# EAGLE schematic wio terminal (EAGLE 9.5.2)
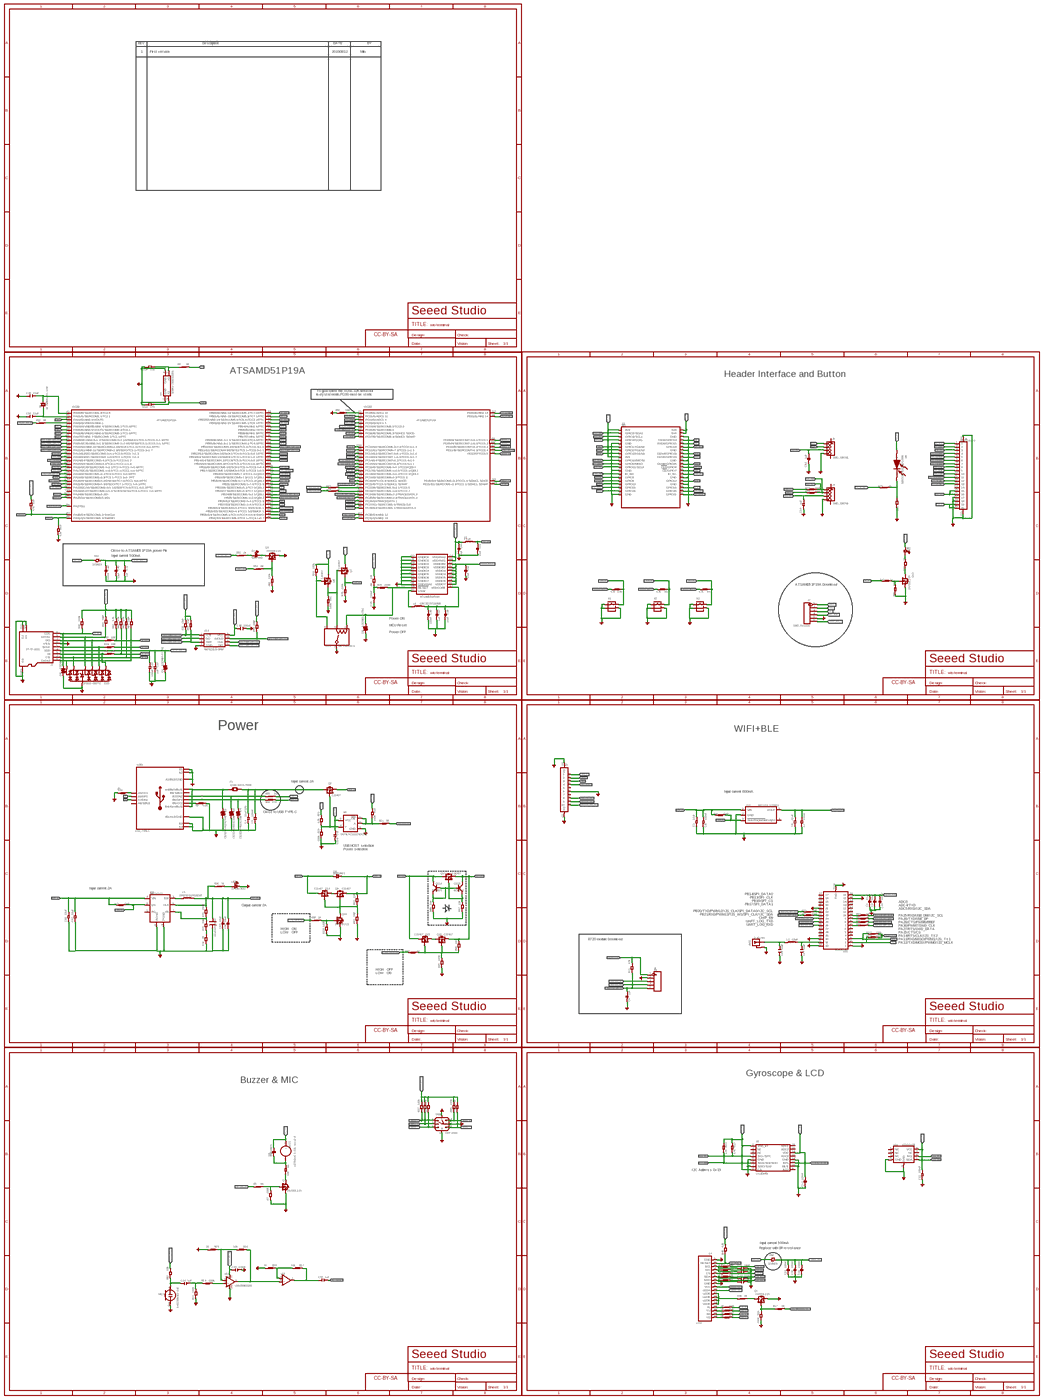
[diagram p0: schematic, sheet 1, overview]
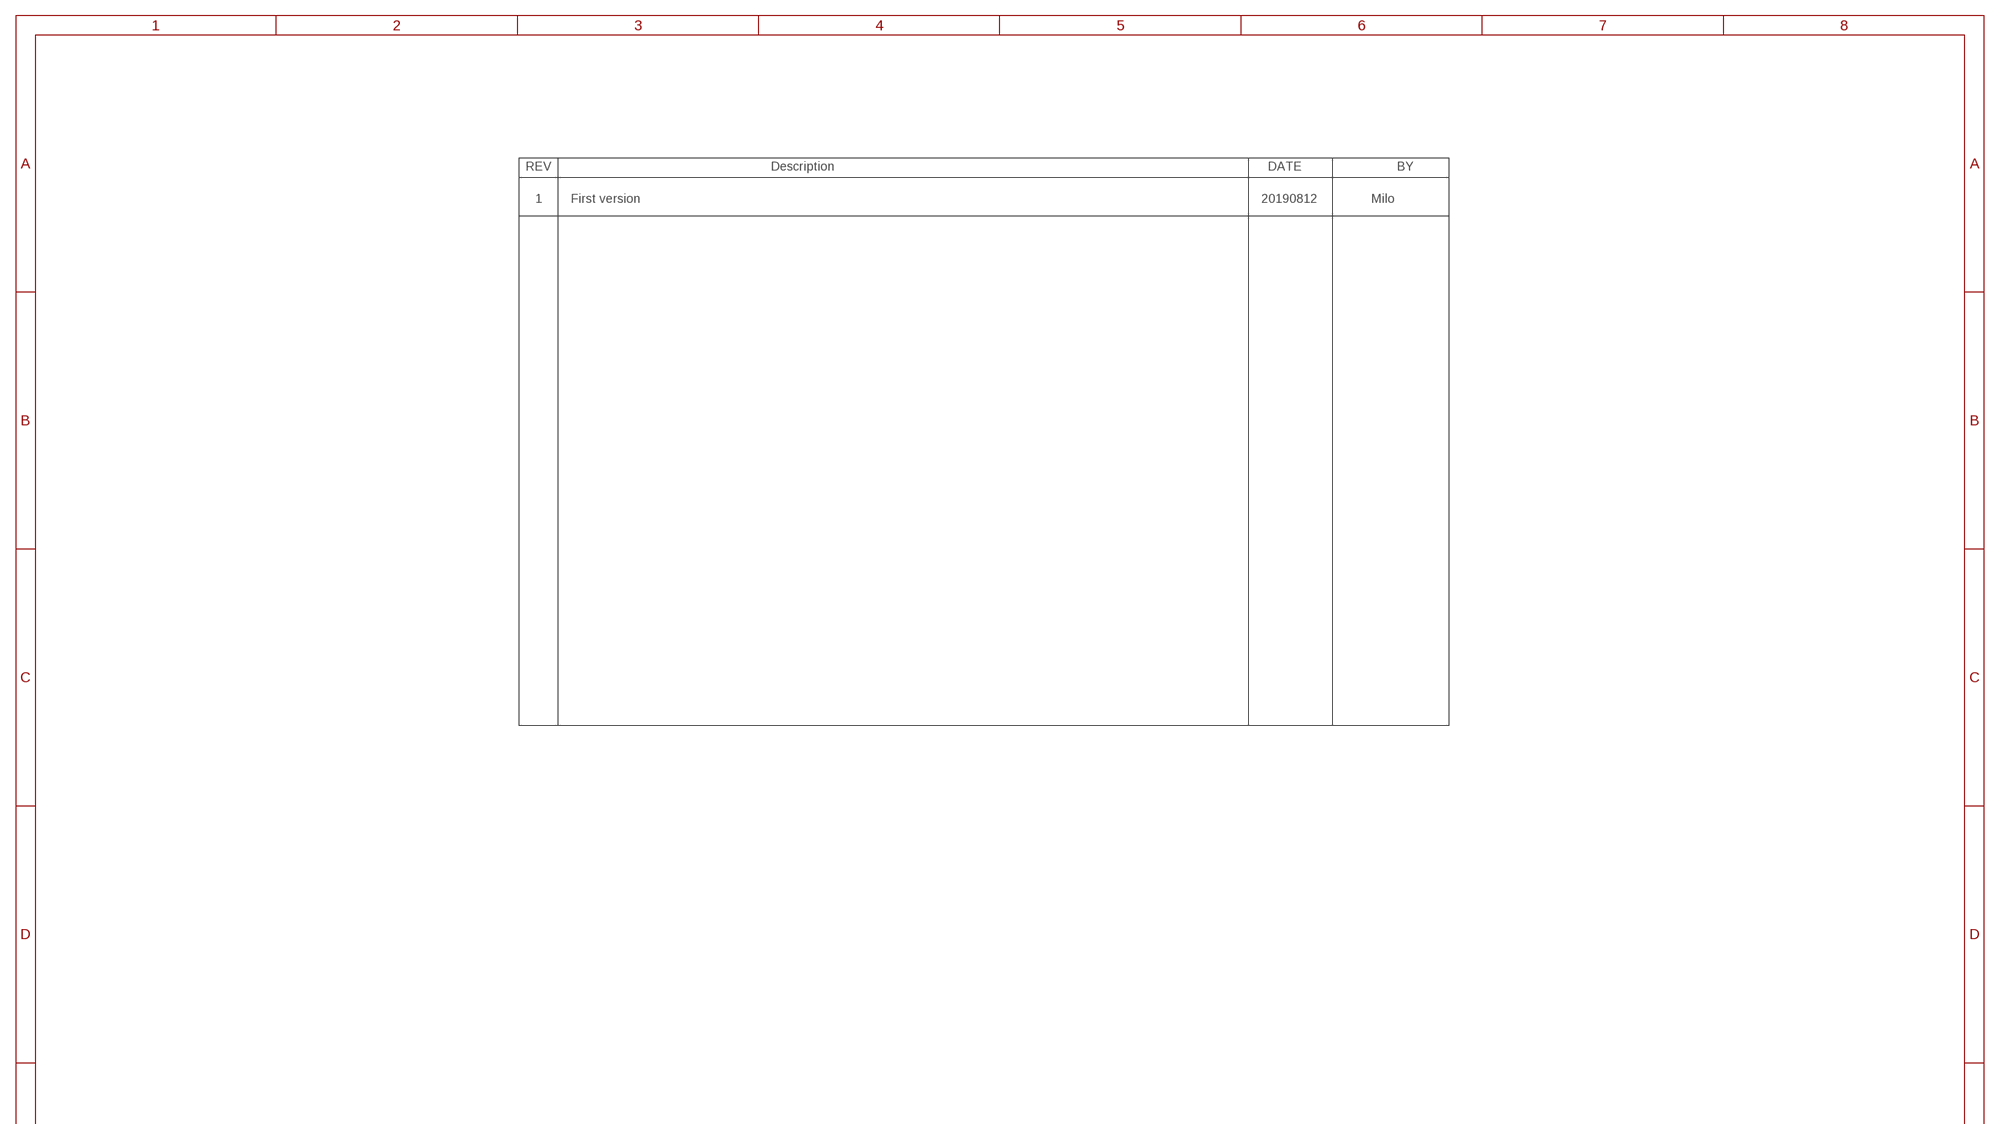
[diagram p1: schematic, sheet 1, part 1 of 7]
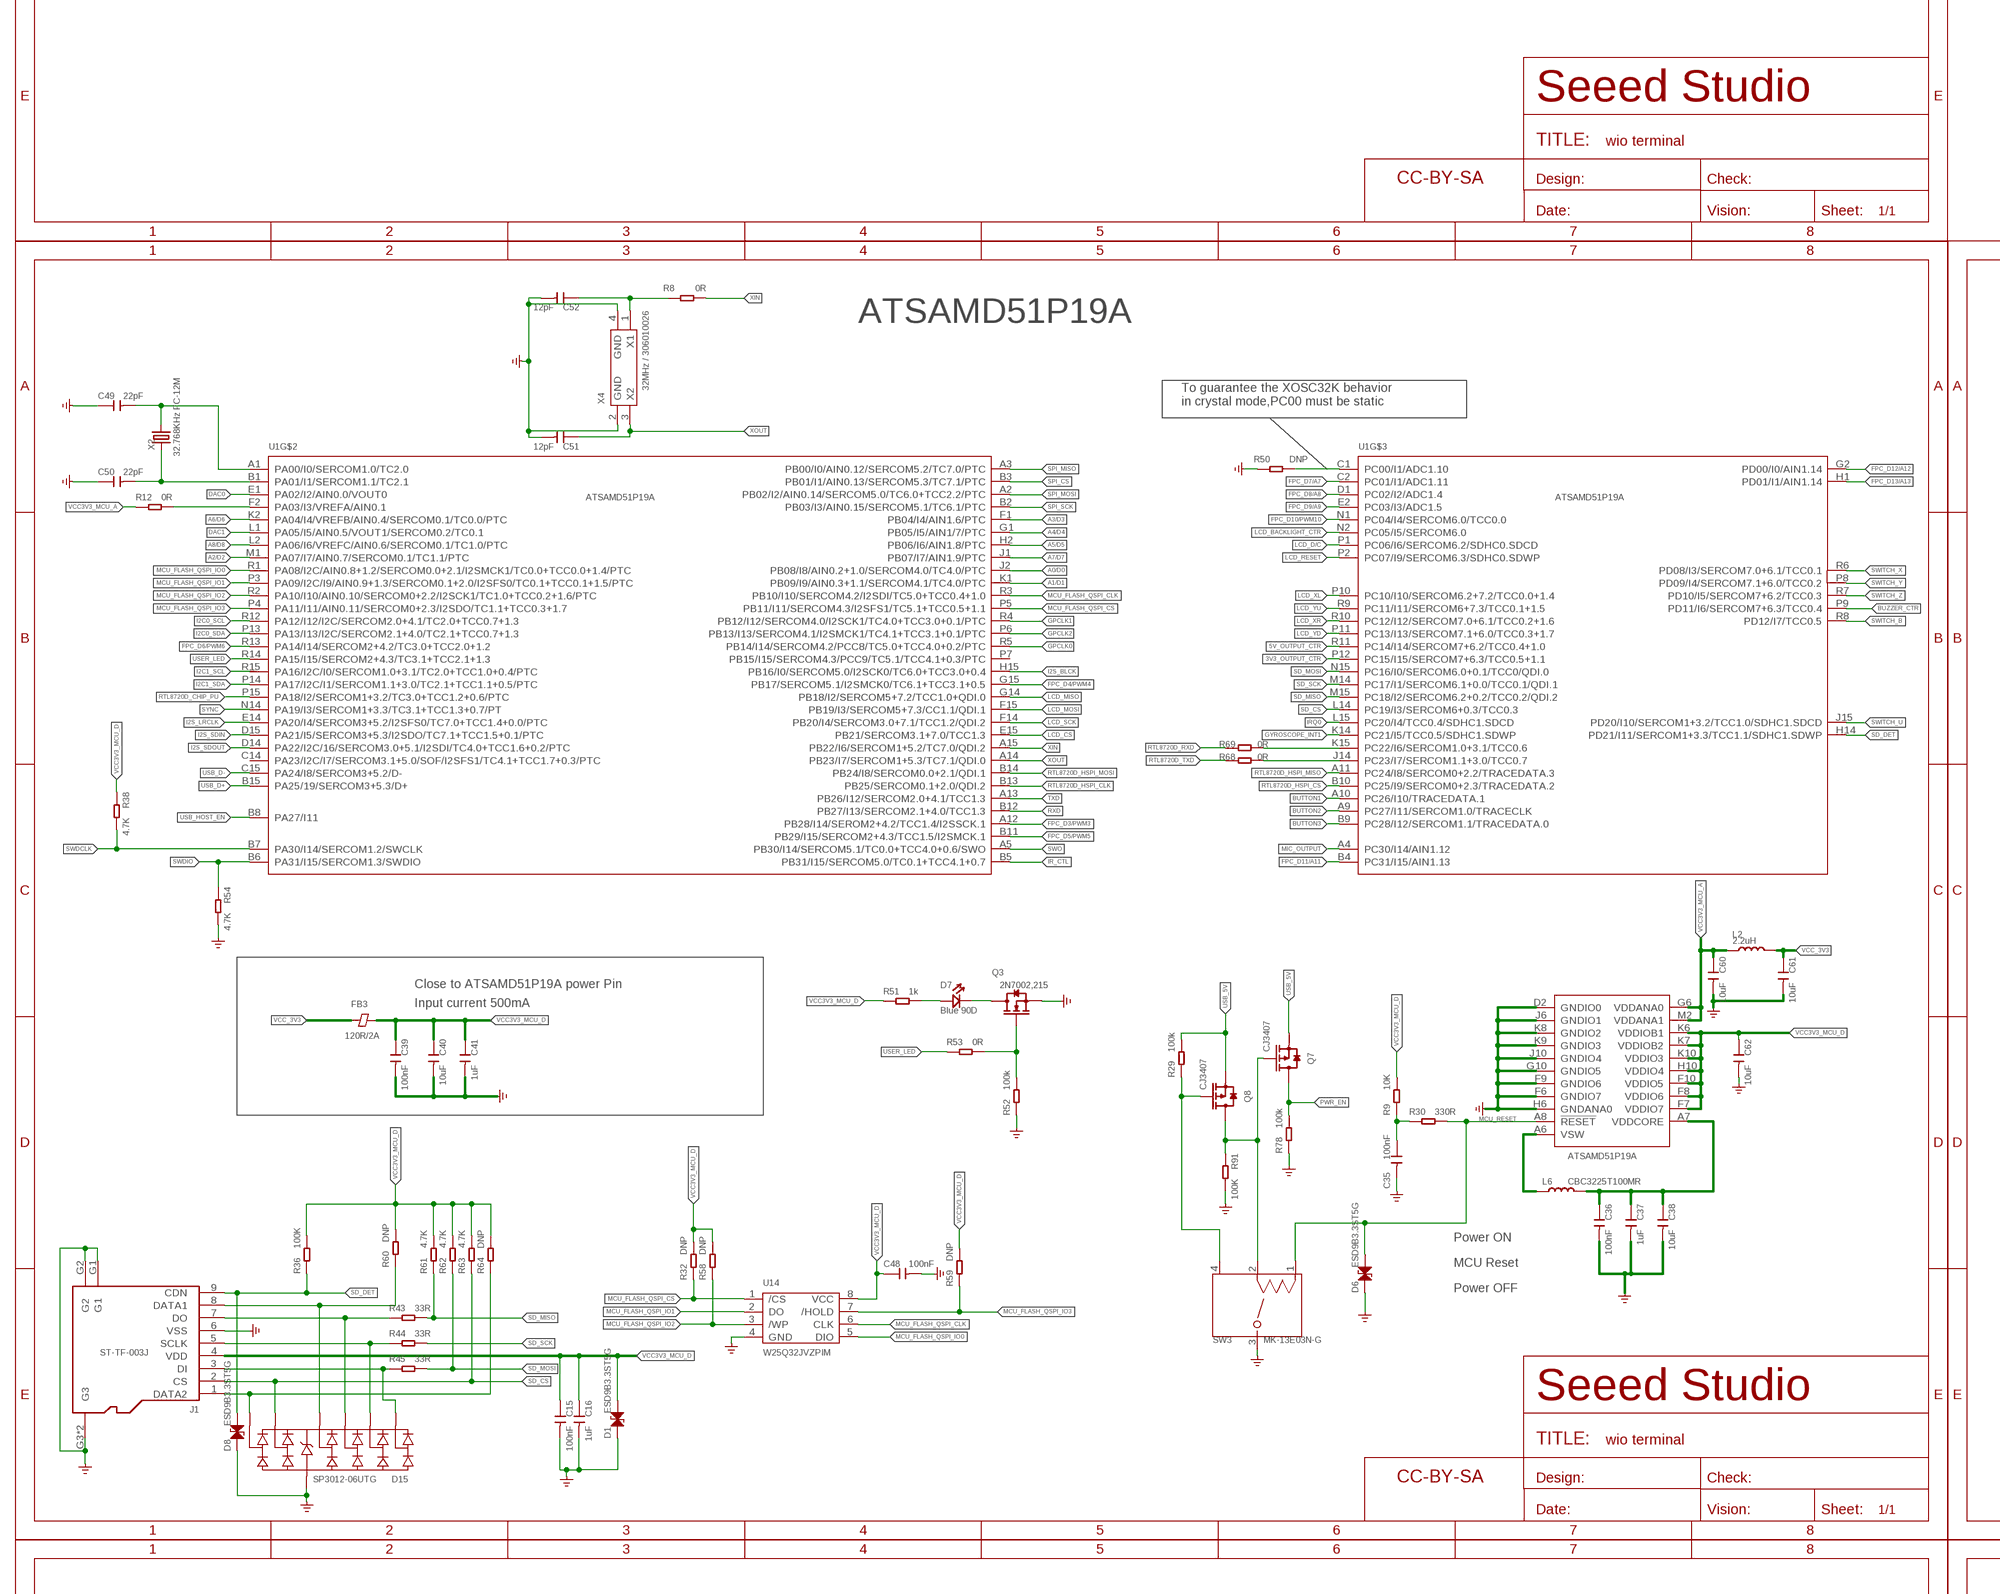
[diagram p2: schematic, sheet 1, part 2 of 7]
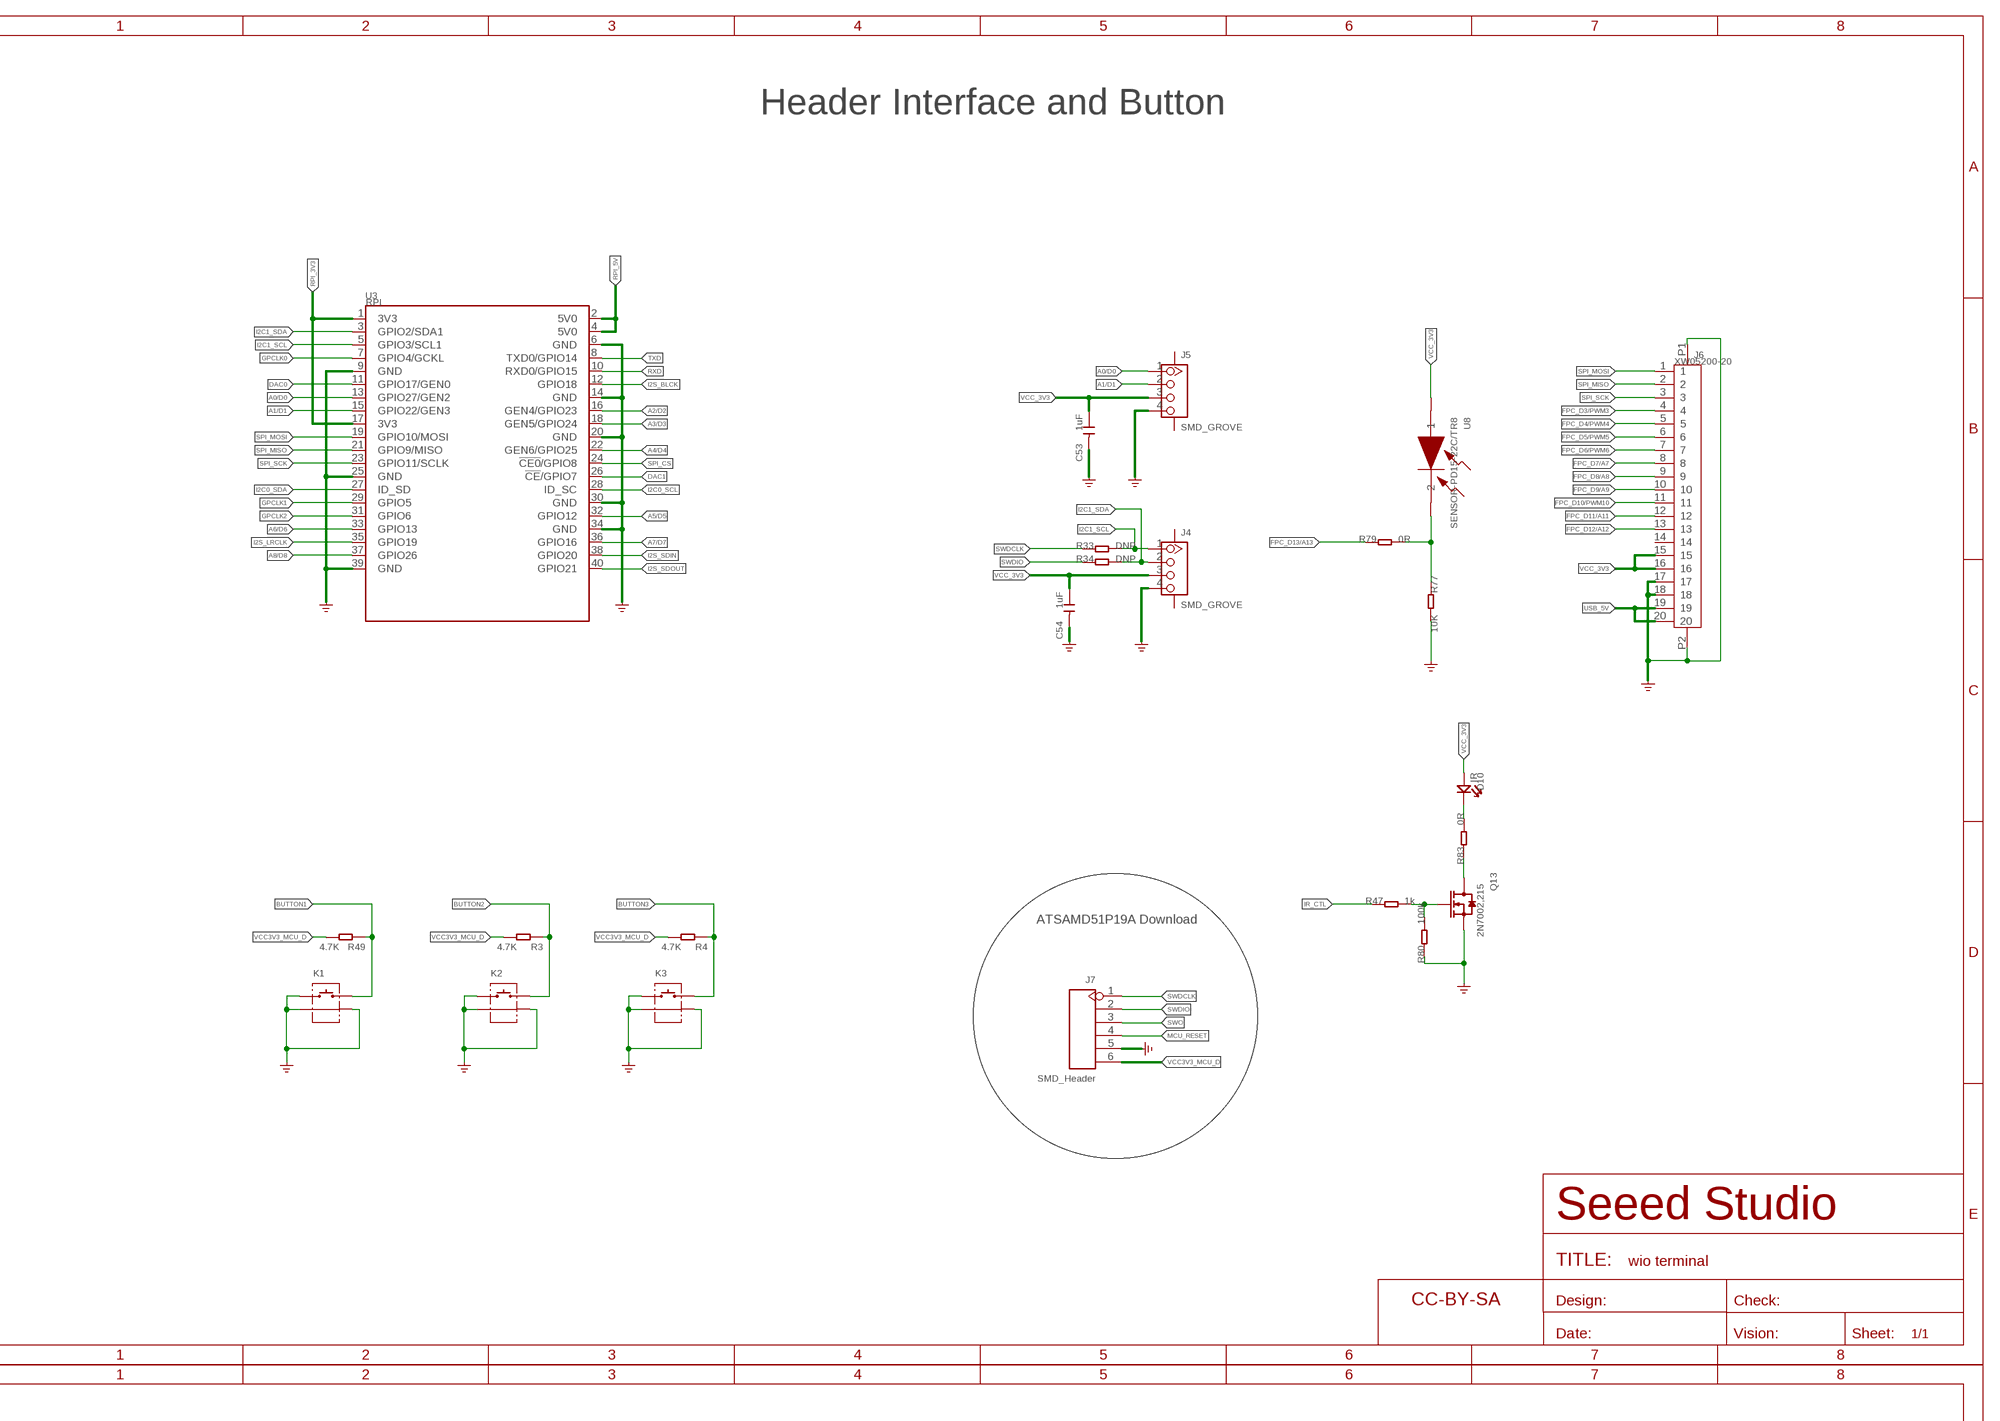
[diagram p3: schematic, sheet 1, part 3 of 7]
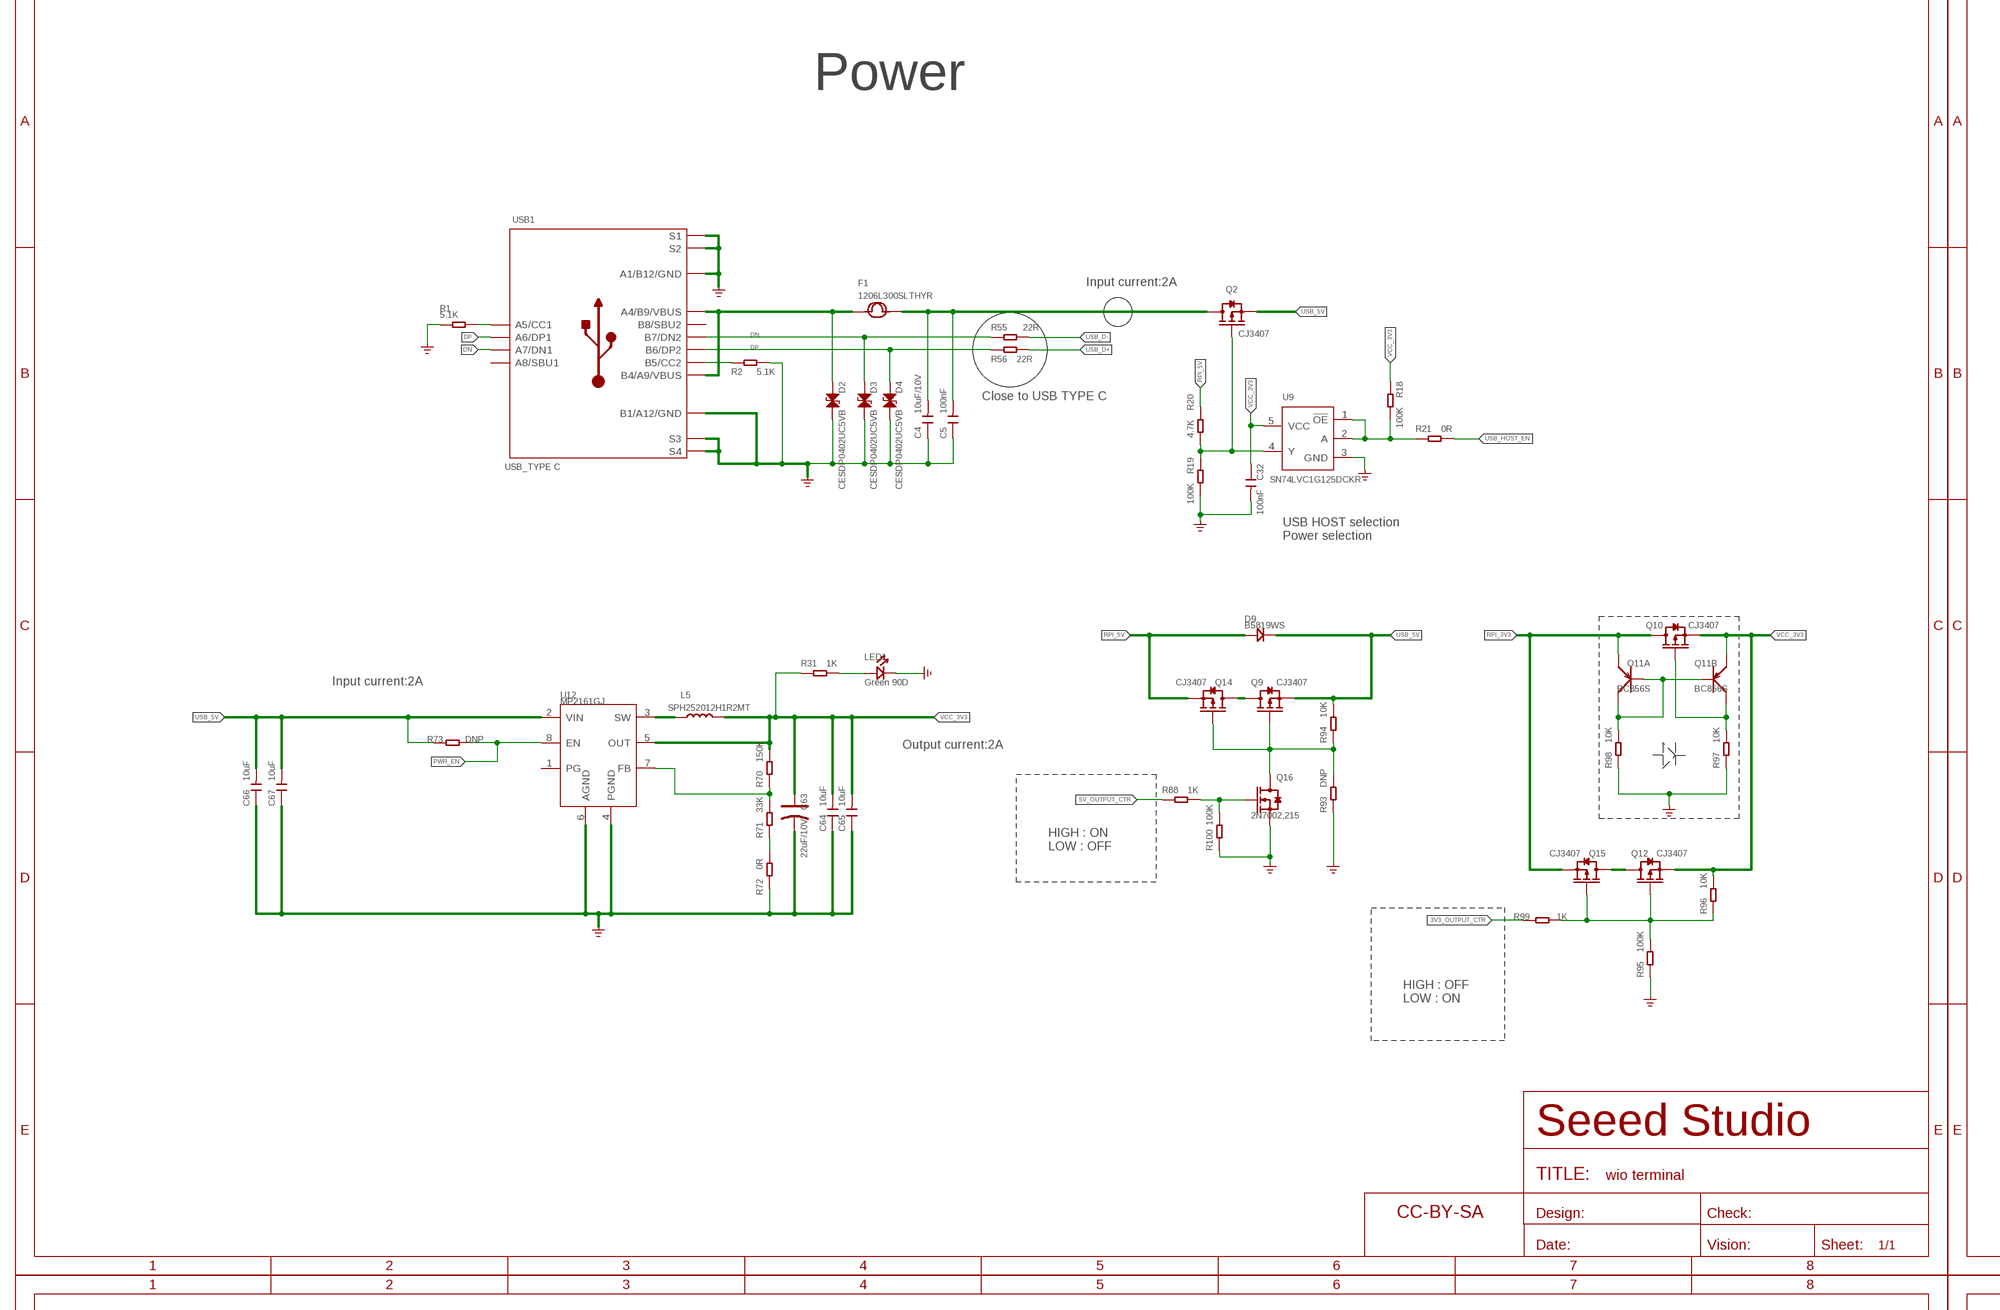
[diagram p4: schematic, sheet 1, part 4 of 7]
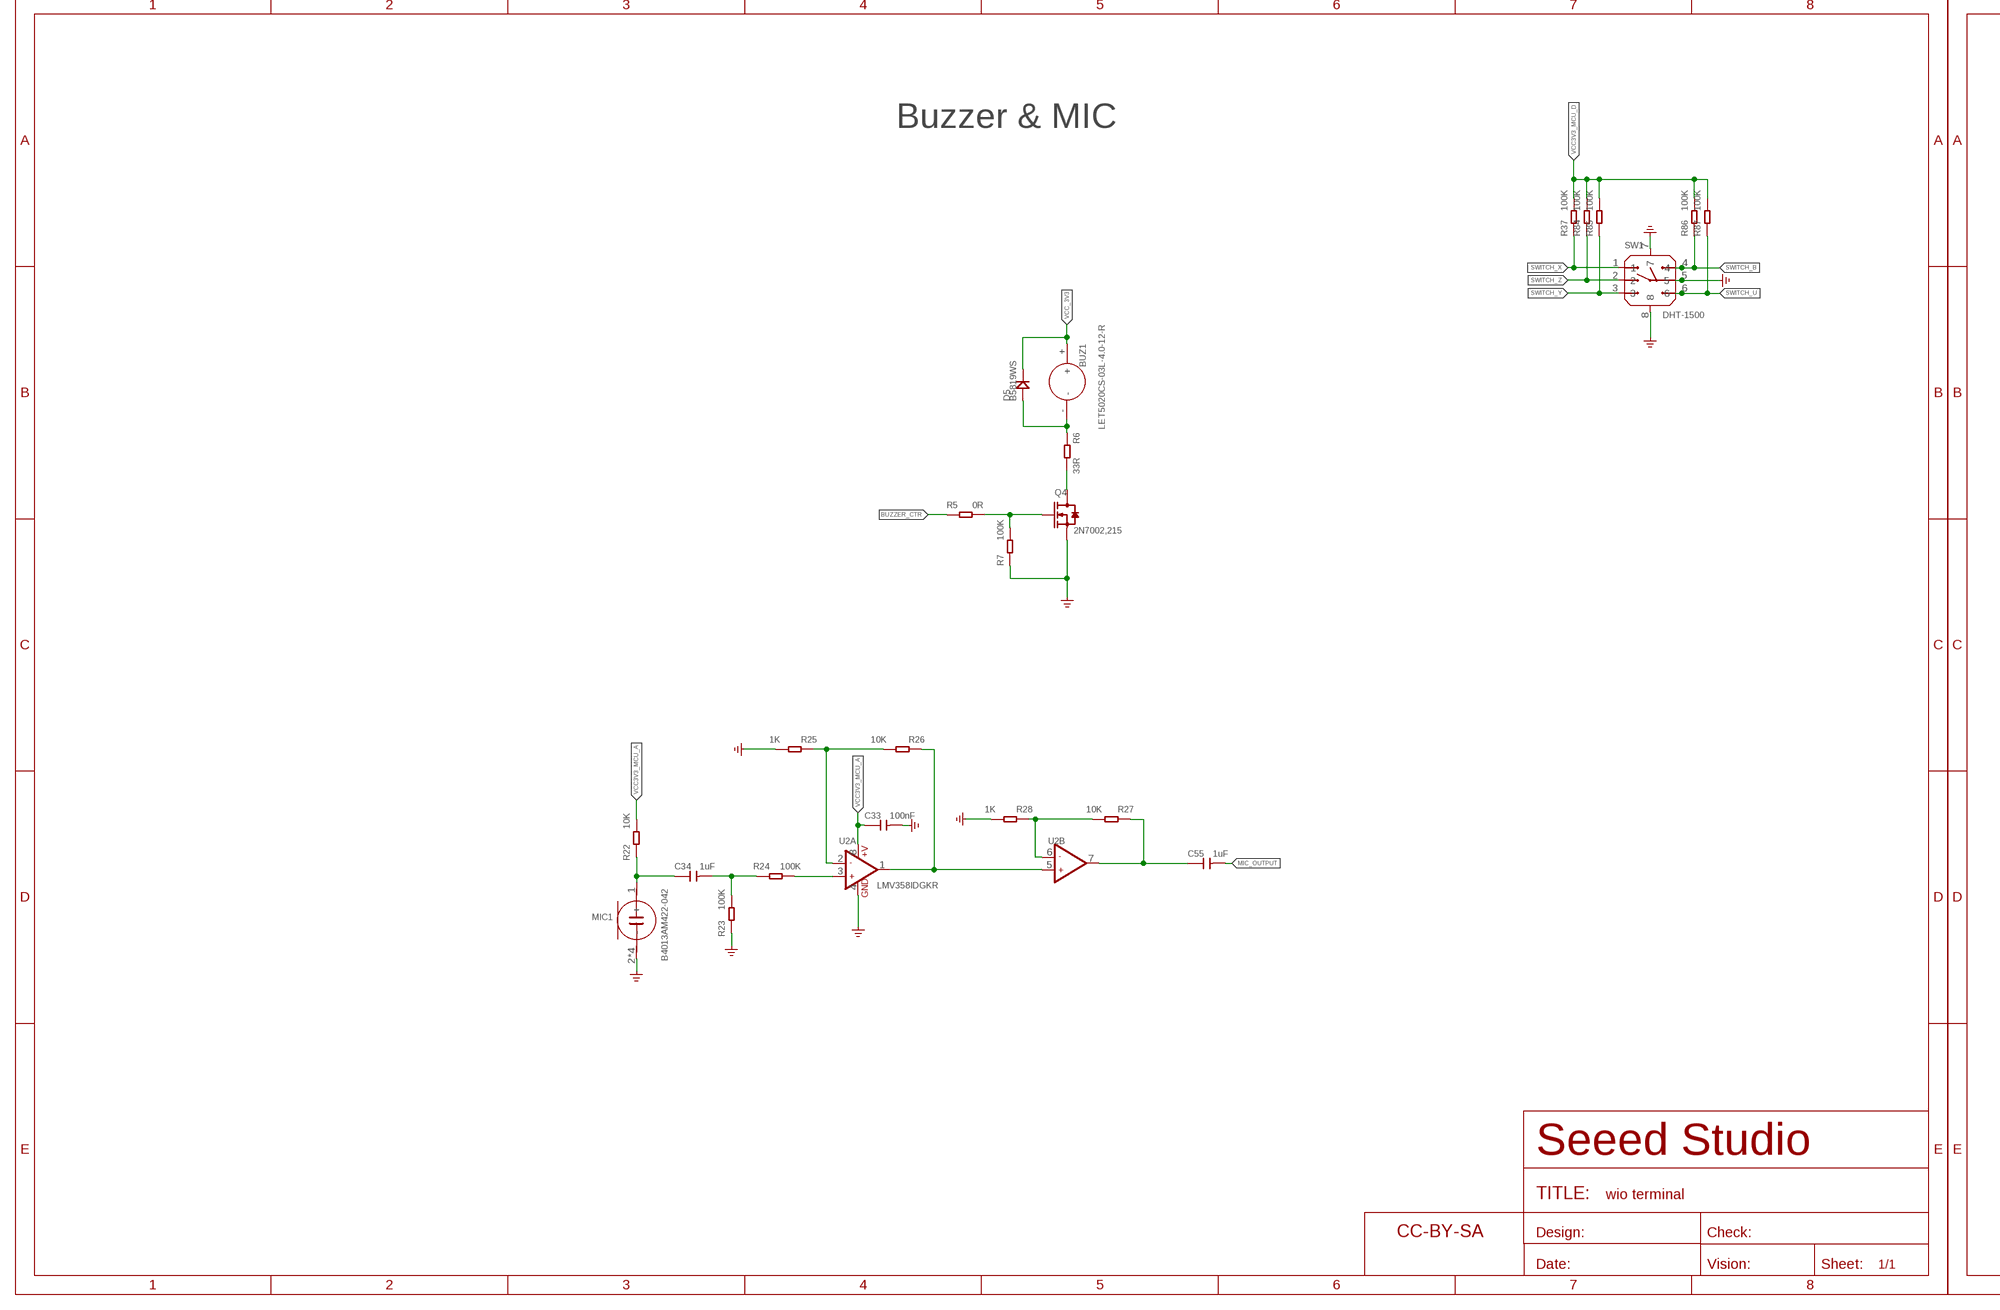
[diagram p5: schematic, sheet 1, part 5 of 7]
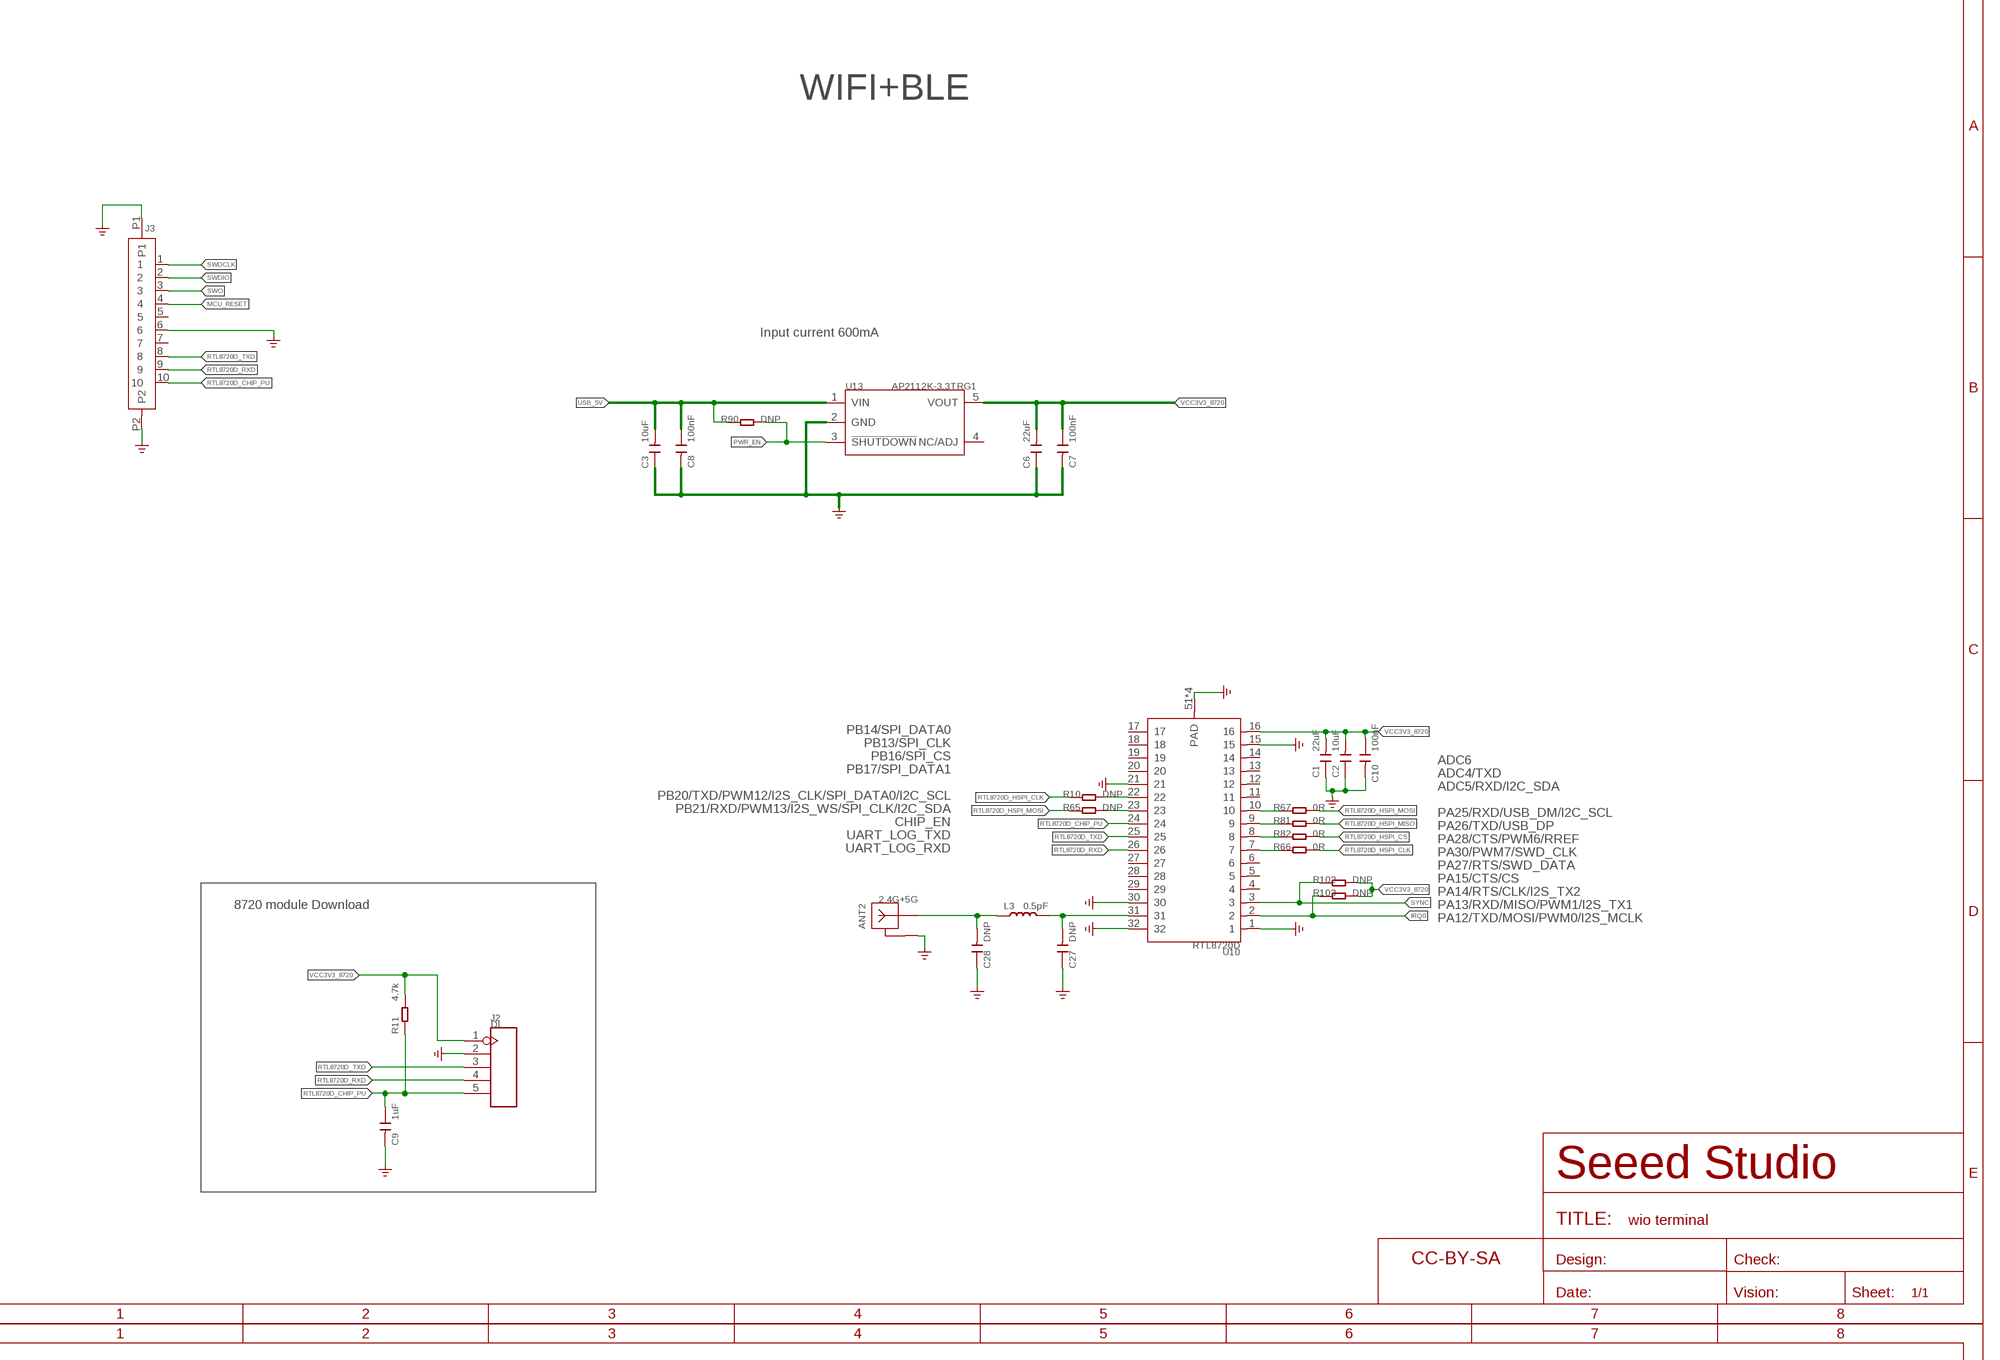
[diagram p6: schematic, sheet 1, part 6 of 7]
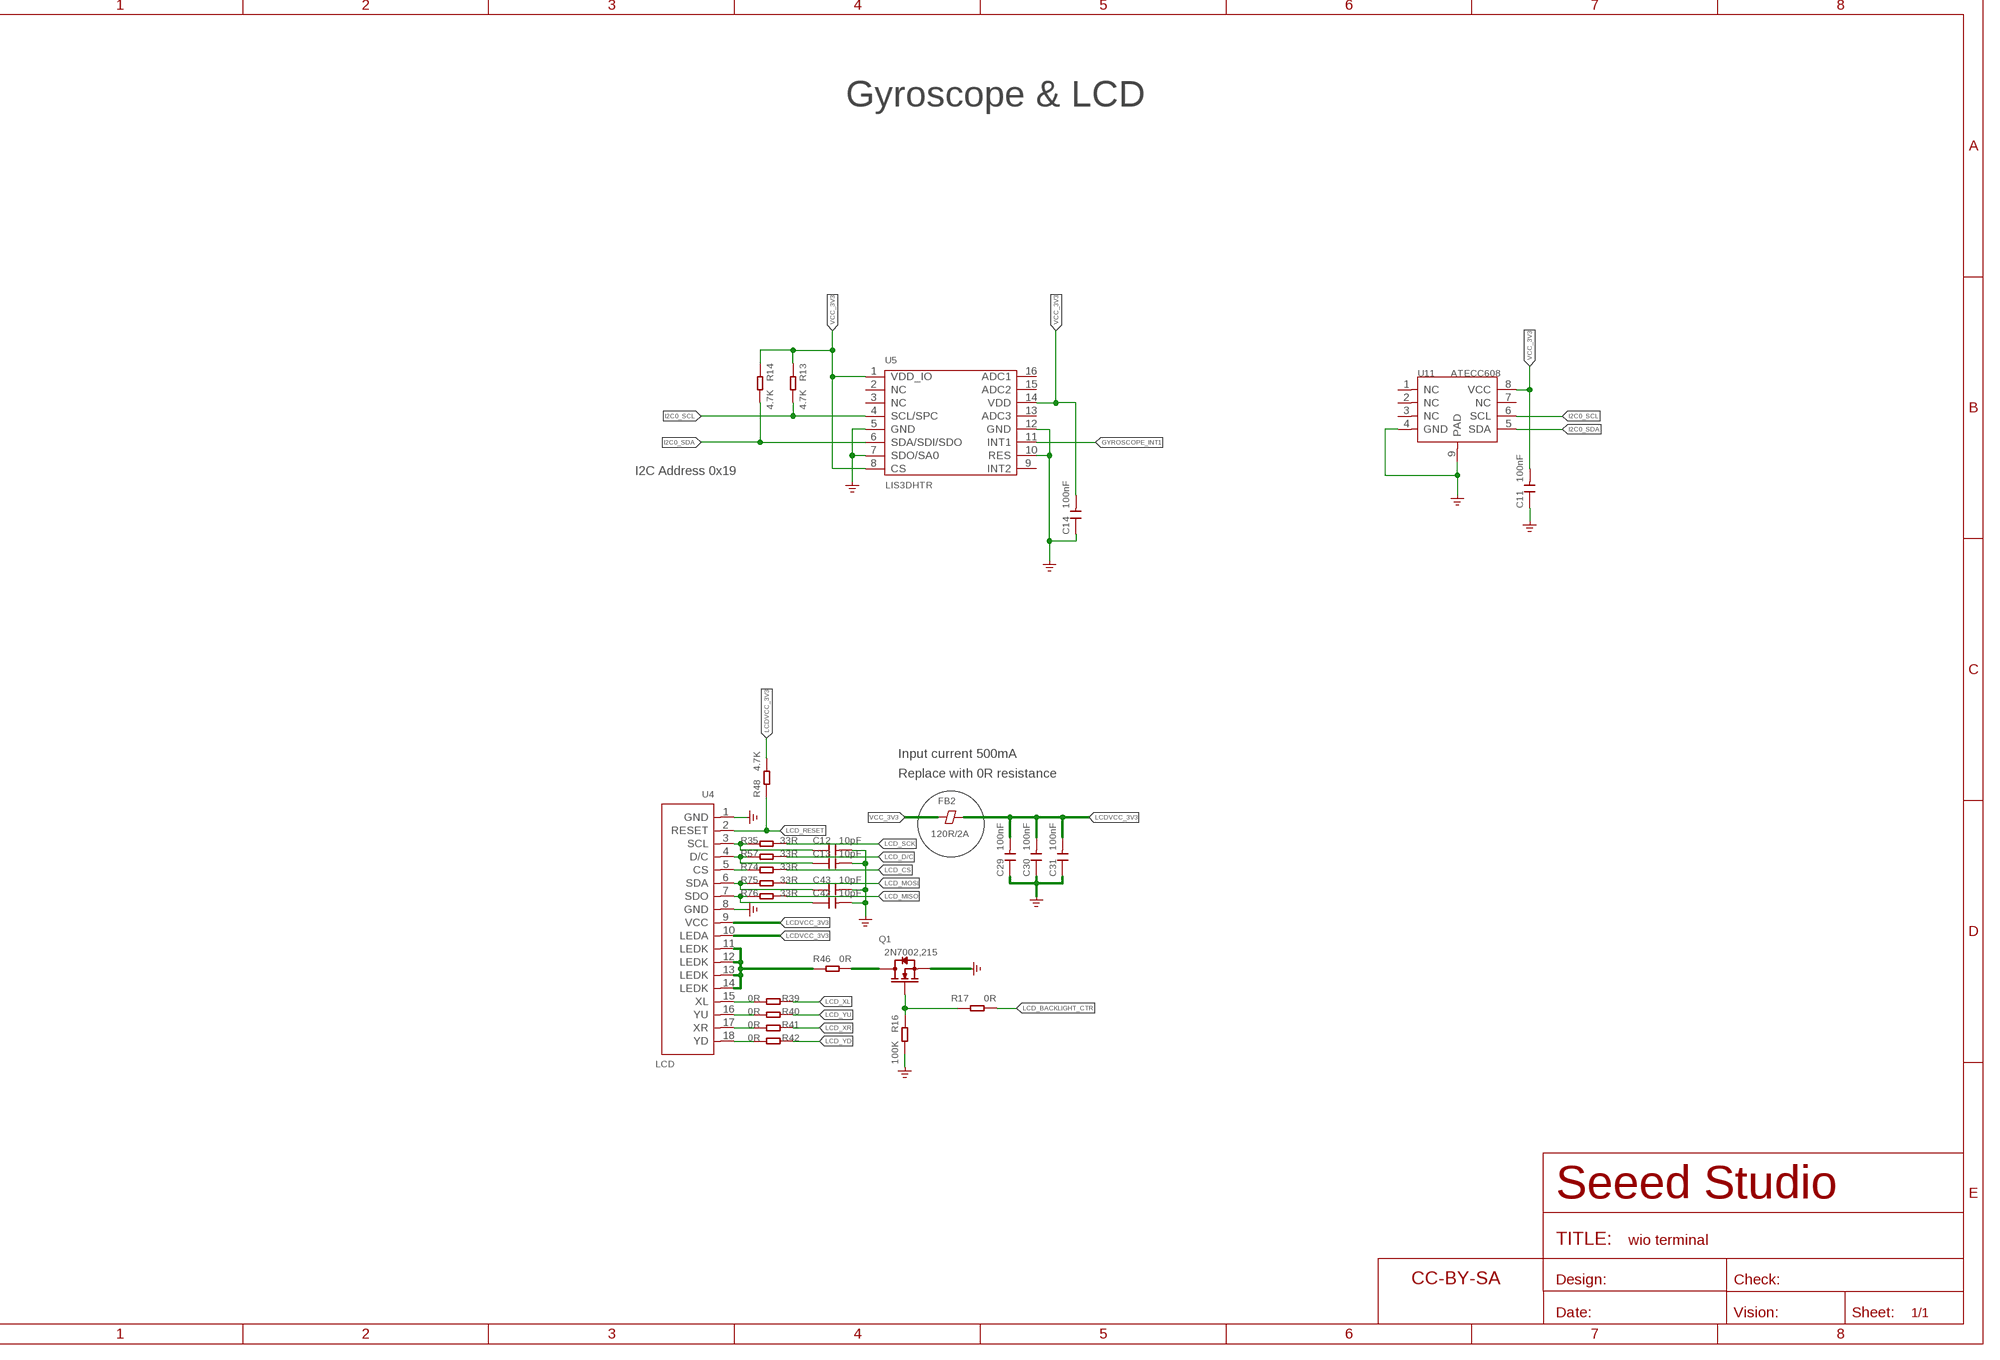
[diagram p7: schematic, sheet 1, part 7 of 7]

## Parts
ANT2  2.4G+5G  ANTENNA-2.4G-ANT-AMEBA-D  [ANT2P-AMEBA-D-MODULE]
BUZ1  LET5020CS-03L-4.0-12-R  BUZZER-312020004  [BZ3-SMD-5.0X5.0X2.5MM]
C1  22uF  CAP-0603  [C0603]
C2  10uF  CAP-0603  [C0603]
C3  10uF  CAP-0603  [C0603]
C4  10uF/10V  CAP-0603  [C0603]
C5  100nF  CAP-0402  [C0402]
C6  22uF  CAP-0603  [C0603]
C7  100nF  CAP-0402  [C0402]
C8  100nF  CAP-0402  [C0402]
C9  1uF  CAP-0402  [C0402]
C10  100nF  CAP-0402  [C0402]
C11  100nF  CAP-0402  [C0402]
C12  10pF  CAP-0402  [C0402]
C13  10pF  CAP-0402  [C0402]
C14  100nF  CAP-0402  [C0402]
C15  100nF  CAP-0402  [C0402]
C16  1uF  CAP-0402  [C0402]
C27  DNP  CAP-0402  [C0402]
C28  DNP  CAP-0402  [C0402]
C29  100nF  CAP-0402  [C0402]
C30  100nF  CAP-0402  [C0402]
C31  100nF  CAP-0402  [C0402]
C32  100nF  CAP-0402  [C0402]
C33  100nF  CAP-0402  [C0402]
C34  1uF  CAP-0402  [C0402]
C35  100nF  CAP-0402  [C0402]
C36  100nF  CAP-0402  [C0402]
C37  1uF  CAP-0402  [C0402]
C38  10uF  CAP-0402  [C0402]
C39  100nF  CAP-0402  [C0402]
C40  10uF  CAP-0402  [C0402]
C41  1uF  CAP-0402  [C0402]
C42  10pF  CAP-0402  [C0402]
C43  10pF  CAP-0402  [C0402]
C48  100nF  CAP-0402  [C0402]
C49  22pF  CAP-0402  [C0402]
C50  22pF  CAP-0402  [C0402]
C51  12pF  CAP-0402  [C0402]
C52  12pF  CAP-0402  [C0402]
C53  1uF  CAP-0402  [C0402]
C54  1uF  CAP-0402  [C0402]
C55  1uF  CAP-0402  [C0402]
C60  10uF  CAP-0402  [C0402]
C61  10uF  CAP-0402  [C0402]
C62  10uF  CAP-0402  [C0402]
C63  22uF/10V  CAP-POLAR-AVX-A  [AVX-A]
C64  10uF  CAP-0402  [C0402]
C65  10uF  CAP-0402  [C0402]
C66  10uF  CAP-0402  [C0402]
C67  10uF  CAP-0402  [C0402]
D1  ESD9B3.3ST5G  D-ESD-2P-DOUBLE-0402  [ESD-0402]
D2  CESDP0402UC5VB  D-ESD-2P-DOUBLE-0402  [ESD-0402]
D3  CESDP0402UC5VB  D-ESD-2P-DOUBLE-0402  [ESD-0402]
D4  CESDP0402UC5VB  D-ESD-2P-DOUBLE-0402  [ESD-0402]
D5  B5819WS  DIODE'0805'  [SOD-323]
D6  ESD9B3.3ST5G  D-ESD-2P-DOUBLE-0402  [ESD-0402]
D7  Blue 90D  LED'RIGHT'  [LED-SIDE-VIEW-0603-RIGHT]
D8  ESD9B3.3ST5G  D-ESD-2P-DOUBLE-0402  [ESD-0402]
D9  B5819WS  DIODE'0805'  [SOD-323]
D10  IR  LED'0603'  [LED-0603]
D15  SP3012-06UTG  D-ESD-14P  [UDFN14-0.5-3.5X1.35X0.5MM]
F1  1206L300SLTHYR  FUSE'1206'  [F1206]
FB2  120R/2A  FERRITE-BEAD-0402  [F0402]
FB3  120R/2A  FERRITE-BEAD-0402  [F0402]
J1  ST-TF-003J  MICRO-SD-CARD-HOLDER-9P-320090000  [MICRO-SD9+4P-SMD-16.1X14.5X1.85MM]
J2  DL  HEADER-5P-TEST  [H5-SMD-2.0-TEST]
J3  FPC-CONNECTOR-10PTOP''  [FPC10-SMD-0.5-10.6X3.5X4.5MM]
J4  SMD_GROVE  GROVE-CONNECTOR-SMD-320110032  [HW4-SMD-2.0-90D]
J5  SMD_GROVE  GROVE-CONNECTOR-SMD-320110032  [HW4-SMD-2.0-90D]
J6  XW05200-20  FPC-CONNECTOR-20P  [FPC20-SMD-0.5-90D]
J7  SMD_Header  HEADER-6P-2.0-TEST  [H6-SMD-2.0_TEST]
K1  BUTTON-2+2P-TS-1073B  [SW2+2P-3.45-4.8X2.5X1.8MM]
K2  BUTTON-2+2P-TS-1073B  [SW2+2P-3.45-4.8X2.5X1.8MM]
K3  BUTTON-2+2P-TS-1073B  [SW2+2P-3.45-4.8X2.5X1.8MM]
L2  2.2uH  INDUCTOR'0805'  [L0805]
L3  0.5pF  INDUCTOR'0402'  [L0402]
L5  SPH252012H1R2MT  INDUCTOR-2520  [L2520]
L6  CBC3225T100MR  INDUCTOR-2520  [L2520]
LED1  Green 90D  LED'RIGHT'  [LED-SIDE-VIEW-0603-RIGHT]
MIC1  B4013AM422-042  MIC2P-B4013AM422-042  [MIC2-SMD-4X4MM]
Q1  2N7002,215  MOSFET-N'SOT23'  [SOT-23]
Q2  CJ3407  MOSFET-P'SI2323CDS/SI2305DS<BR>'  [SOT-23]
Q3  2N7002,215  MOSFET-N'SOT23'  [SOT-23]
Q4  2N7002,215  MOSFET-N'SOT23'  [SOT-23]
Q7  CJ3407  MOSFET-P'SI2323CDS/SI2305DS<BR>'  [SOT-23]
Q8  CJ3407  MOSFET-P'SI2323CDS/SI2305DS<BR>'  [SOT-23]
Q9  CJ3407  MOSFET-P'SI2323CDS/SI2305DS<BR>'  [SOT-23]
Q10  CJ3407  MOSFET-P'SI2323CDS/SI2305DS<BR>'  [SOT-23]
Q11  BC856S  TRANSISTOR-DUAL-PNP-SC-88  [SOT-363]
Q12  CJ3407  MOSFET-P'SI2323CDS/SI2305DS<BR>'  [SOT-23]
Q13  2N7002,215  MOSFET-N'SOT23'  [SOT-23]
Q14  CJ3407  MOSFET-P'SI2323CDS/SI2305DS<BR>'  [SOT-23]
Q15  CJ3407  MOSFET-P'SI2323CDS/SI2305DS<BR>'  [SOT-23]
Q16  2N7002,215  MOSFET-N'SOT23'  [SOT-23]
R1  5.1K  RES-0402  [R0402]
R2  5.1K  RES-0402  [R0402]
R3  4.7K  RES-0402  [R0402]
R4  4.7K  RES-0402  [R0402]
R5  0R  RES-0402  [R0402]
R6  33R  RES-0402  [R0402]
R7  100K  RES-0402  [R0402]
R8  0R  RES-0402  [R0402]
R9  10K  RES-0402  [R0402]
R10  DNP  RES-0402  [R0402]
R11  4.7k  RES-0402  [R0402]
R12  0R  RES-0402  [R0402]
R13  4.7K  RES-0402  [R0402]
R14  4.7K  RES-0402  [R0402]
R16  100K  RES-0402  [R0402]
R17  0R  RES-0402  [R0402]
R18  100K  RES-0402  [R0402]
R19  100K  RES-0402  [R0402]
R20  4.7K  RES-0402  [R0402]
R21  0R  RES-0402  [R0402]
R22  10K  RES-0402  [R0402]
R23  100K  RES-0402  [R0402]
R24  100K  RES-0402  [R0402]
R25  1K  RES-0402  [R0402]
R26  10K  RES-0402  [R0402]
R27  10K  RES-0402  [R0402]
R28  1K  RES-0402  [R0402]
R29  100k  RES-0402  [R0402]
R30  330R  RES-0402  [R0402]
R31  1K  RES-0402  [R0402]
R32  DNP  RES-0402  [R0402]
R33  DNP  RES-0402  [R0402]
R34  DNP  RES-0402  [R0402]
R35  33R  RES-0402  [R0402]
R36  100K  RES-0402  [R0402]
R37  100K  RES-0402  [R0402]
R38  4.7K  RES-0402  [R0402]
R39  0R  RES-0402  [R0402]
R40  0R  RES-0402  [R0402]
R41  0R  RES-0402  [R0402]
R42  0R  RES-0402  [R0402]
R43  33R  RES-0402  [R0402]
R44  33R  RES-0402  [R0402]
R45  33R  RES-0402  [R0402]
R46  0R  RES-0402  [R0402]
R47  1k  RES-0402  [R0402]
R48  4.7K  RES-0402  [R0402]
R49  4.7K  RES-0402  [R0402]
R50  DNP  RES-0402  [R0402]
R51  1k  RES-0402  [R0402]
R52  100k  RES-0402  [R0402]
R53  0R  RES-0402  [R0402]
R54  4.7K  RES-0402  [R0402]
R55  22R  RES-0402  [R0402]
R56  22R  RES-0402  [R0402]
R57  33R  RES-0402  [R0402]
R58  DNP  RES-0402  [R0402]
R59  DNP  RES-0402  [R0402]
R60  DNP  RES-0402  [R0402]
R61  4.7K  RES-0402  [R0402]
R62  4.7K  RES-0402  [R0402]
R63  4.7K  RES-0402  [R0402]
R64  DNP  RES-0402  [R0402]
R65  DNP  RES-0402  [R0402]
R66  0R  RES-0402  [R0402]
R67  0R  RES-0402  [R0402]
R68  0R  RES-0402  [R0402]
R69  0R  RES-0402  [R0402]
R70  150K  RES-0402  [R0402]
R71  33K  RES-0402  [R0402]
R72  0R  RES-0402  [R0402]
R73  DNP  RES-0402  [R0402]
R74  33R  RES-0402  [R0402]
R75  33R  RES-0402  [R0402]
R76  33R  RES-0402  [R0402]
R77  10K  RES-0402  [R0402]
R78  100k  RES-0402  [R0402]
R79  0R  RES-0402  [R0402]
R80  100k  RES-0402  [R0402]
R81  0R  RES-0402  [R0402]
R82  0R  RES-0402  [R0402]
R83  0R  RES-0402  [R0402]
R84  100K  RES-0402  [R0402]
R85  100K  RES-0402  [R0402]
R86  100K  RES-0402  [R0402]
R87  100K  RES-0402  [R0402]
R88  1K  RES-0402  [R0402]
R90  DNP  RES-0402  [R0402]
R91  100K  RES-0402  [R0402]
R93  DNP  RES-0402  [R0402]
R94  10K  RES-0402  [R0402]
R95  100K  RES-0402  [R0402]
R96  10K  RES-0402  [R0402]
R97  10K  RES-0402  [R0402]
R98  10K  RES-0402  [R0402]
R99  1K  RES-0402  [R0402]
R100  100K  RES-0402  [R0402]
R102  DNP  RES-0402  [R0402]
R103  DNP  RES-0402  [R0402]
SW1  DHT-1500  SWITCH-2X3P  [SWITCH-2X3P]
SW3  MK-13E03N-G  SWITCH-4P  [SW4-SMD-11.2X3.6MM]
U1  ATSAMD51P19A  MCU-ATSAMD51P19A  [TFBGA120-0.5-8X8MM]
U2  LMV358IDGKR  AMPLIFIER-LMV358-310020007  [MSOP8-0.65-3X3MM]
U3  RPI  RPI-ZERO-LONG  [H2X20-SMD-2.54-50.8X5MM-LONG]
U4  LCD  LCM-RY24009A0-00  [LCM18-0.8-60.26X42.72X2.2MM]
U5  LIS3DHTR  SENSOR-MOTION/POSITION-LIS3DHTR-314080105  [LGA16-0.5-3X3MM]
U8  SENSOR-PD15-22C/TR8  [SNR4-SMD-3.2X2.7MM]
U9  SN74LVC1G125DCKR  LOGIC-SN74LVC1G125DCKR-310050019  [SC-70-5]
U10  RTL8720D  MODULE-8720DN-MOTHER  [MODULE-32P-0.8-13X12MM-MOTHER]
U11  ATECC608  DRIVER-ATECC608A  [UDFN8-0.5-2X3X0.5MM]
U12  MP2161GJ  PMIC-MP2161'GJ'  [TSOT23-8]
U13  AP2112K-3.3TRG1  PMIC-AP2127  [SOT-23-5]
U14  W25Q32JVZPIM  FLASH-W25X80-SS  [SOIC8-1.27-5.3X5.3MM]
USB1  USB_TYPE C  USB2.0-TYPE-C  [USB2.0-TYPE-C]
X2  32.768KHz FC-12M  CRYSTAL-2P'NX2012SA'  [X2-SMD-L2.0X1.2X0.55MM]
X4  32MHz / 306010026  CRYSTAL-4P-3225  [X4-SMD-3.2X2.5X0.7MM]

## Nets
3V3_OUTPUT_CTR: R99.2 U1.P12(PC15/I15/SERCOM7+6.3/TCC0.5+1.1)
5V_OUTPUT_CTR: R88.1 U1.R11(PC14/I14/SERCOM7+6.2/TCC0.4+1.0)
A0/D0: J5.1 U1.J2(PB08/I8/AIN0.2+1.0/SERCOM4.0/TC4.0/PTC) U3.13(GPIO27/GEN2)
A1/D1: J5.2 U1.K1(PB09/I9/AIN0.3+1.1/SERCOM4.1/TC4.0/PTC) U3.15(GPIO22/GEN3)
A2/D2: U1.M1(PA07/I7/AIN0.7/SERCOM0.1/TC1.1/PTC) U3.16(GEN4/GPIO23)
A3/D3: U1.F1(PB04/I4/AIN1.6/PTC) U3.18(GEN5/GPIO24)
A4/D4: U1.G1(PB05/I5/AIN1/7/PTC) U3.22(GEN6/GPIO25)
A5/D5: U1.H2(PB06/I6/AIN1.8/PTC) U3.32(GPIO12)
A6/D6: U1.K2(PA04/I4/VREFB/AIN0.4/SERCOM0.1/TC0.0/PTC) U3.33(GPIO13)
A7/D7: U1.J1(PB07/I7/AIN1.9/PTC) U3.36(GPIO16)
A8/D8: U1.L2(PA06/I6/VREFC/AIN0.6/SERCOM0.1/TC1.0/PTC) U3.37(GPIO26)
BUTTON1: K1.2 R49.1 U1.A10(PC26/I10/TRACEDATA.1)
BUTTON2: K2.2 R3.1 U1.A9(PC27/I11/SERCOM1.0/TRACECLK)
BUTTON3: K3.2 R4.1 U1.B9(PC28/I12/SERCOM1.1/TRACEDATA.0)
BUZZER_CTR: R5.1 U1.P9(PD11/I6/SERCOM7+6.3/TCC0.4)
DAC0: U1.E1(PA02/I2/AIN0.0/VOUT0) U3.11(GPIO17/GEN0)
DAC1: U1.L1(PA05/I5/AIN0.5/VOUT1/SERCOM0.2/TC0.1) U3.26(!CE!/GPIO7)
DN: D3.1 R55.1 USB1.A7(A7/DN1) USB1.B7(B7/DN2)
DP: D4.1 R56.2 USB1.A6(A6/DP1) USB1.B6(B6/DP2)
FPC_D3/PWM3: J6.4 U1.A12(PB28/I14/SEROM2+4.2/TCC1.4/I2SSCK.1)
FPC_D4/PWM4: J6.5 U1.G15(PB17/SERCOM5.1/I2SMCK0/TC6.1+TCC3.1+0.5)
FPC_D5/PWM5: J6.6 U1.B11(PB29/I15/SERCOM2+4.3/TCC1.5/I2SMCK.1)
FPC_D6/PWM6: J6.7 U1.R13(PA14/I14/SERCOM2+4.2/TC3.0+TCC2.0+1.2)
FPC_D7/A7: J6.8 U1.C2(PC01/I1/ADC1.11)
FPC_D8/A8: J6.9 U1.D1(PC02/I2/ADC1.4)
FPC_D9/A9: J6.10 U1.E2(PC03/I3/ADC1.5)
FPC_D10/PWM10: J6.11 U1.N1(PC04/I4/SERCOM6.0/TCC0.0)
FPC_D11/A11: J6.12 U1.B4(PC31/I15/AIN1.13)
FPC_D12/A12: J6.13 U1.G2(PD00/I0/AIN1.14)
FPC_D13/A13: R79.2 U1.H1(PD01/I1/AIN1.14)
GND: ANT2.1 C1.1 C2.1 C3.1 C4.1 C5.1 C6.1 C7.2 C8.2 C9.2 C10.2 C11.1 C12.2 C13.2 C14.1 C15.2 C16.2 C27.1 C28.1 C29.1 C30.1 C31.1 C32.2 C33.2 C35.2 C36.2 C37.2 C38.2 C39.2 C40.2 C41.2 C42.2 C43.2 C48.2 C49.1 C50.1 C51.2 C52.2 C53.2 C54.2 C60.2 C61.2 C62.2 C63.- C64.1 C65.1 C66.1 C67.1 D1.1 D2.2 D3.2 D4.2 D6.1 D8.1 D15.5 D15.10 J1.6(VSS) J1.G1 J1.G2 J1.G3 J1.G4(G3) J2.2 J3.6 J3.P1 J3.P2 J4.4 J5.4 J6.17 J6.18 J6.P1 J6.P2 J7.5 K1.1 K1.3(S1) K1.4(S2) K2.1 K2.3(S1) K2.4(S2) K3.1 K3.3(S1) K3.4(S2) LED1.2(-) MIC1.2(-) MIC1.3(-) MIC1.4(-) MIC1.5(-) Q1.2(S) Q3.2(S) Q4.2(S) Q13.2(S) Q16.2(S) R1.1 R2.1 R7.1 R16.2 R19.2 R23.2 R25.1 R28.1 R50.2 R52.1 R54.2 R72.1 R77.1 R78.1 R80.2 R91.2 R93.1 R95.1 R97.1 R98.1 R100.1 SW1.5 SW1.7 SW1.8 SW3.3 U1.D2(GNDIO0) U1.F6(GNDIO7) U1.F9(GNDIO6) U1.G10(GNDIO5) U1.H6(GNDANA0) U1.J6(GNDIO1) U1.J10(GNDIO4) U1.K8(GNDIO2) U1.K9(GNDIO3) U2.4(A:GND) U3.6(GND) U3.9(GND) U3.14(GND) U3.20(GND) U3.25(GND) U3.30(GND) U3.34(GND) U3.39(GND) U4.1(GND) U4.8(GND) U5.5(GND) U5.7(SDO/SA0) U5.10(RES) U5.12(GND) U9.3(GND) U10.1 U10.15 U10.21 U10.30 U10.32 U10.51(PAD) U10.54(PAD) U10.60(PAD) U10.61(PAD) U11.4(GND) U11.9(PAD) U12.4(PGND) U12.6(AGND) U13.2(GND) U14.4(GND) USB1.A1_B12(A1/B12/GND) USB1.B1_A12(B1/A12/GND) USB1.S1 USB1.S2 USB1.S3 USB1.S4 USB1.S5(S1) USB1.S6(S2) X4.2(GND) X4.4(GND) ; supply symbol labelled GND_POWER
GPCLK0: U1.R5(PB14/I14/SERCOM4.2/PCC8/TC5.0+TCC4.0+0.2/PTC) U3.7(GPIO4/GCKL)
GPCLK1: U1.R4(PB12/I12/SERCOM4.0/I2SCK1/TC4.0+TCC3.0+0.1/PTC) U3.29(GPIO5)
GPCLK2: U1.P6(PB13/I13/SERCOM4.1/I2SMCK1/TC4.1+TCC3.1+0.1/PTC) U3.31(GPIO6)
GYROSCOPE_INT1: U1.K14(PC21/I5/TCC0.5/SDHC1.SDWP) U5.11(INT1)
I2C0_SCL: R13.2 U1.R12(PA12/I12/I2C/SERCOM2.0+4.1/TC2.0+TCC0.7+1.3) U3.28(ID_SC) U5.4(SCL/SPC) U11.6(SCL)
I2C0_SDA: R14.2 U1.P13(PA13/I13/I2C/SERCOM2.1+4.0/TC2.1+TCC0.7+1.3) U3.27(ID_SD) U5.6(SDA/SDI/SDO) U11.5(SDA)
I2C1_SCL: J4.1 R33.1 U1.R15(PA16/I2C/I0/SERCOM1.0+3.1/TC2.0+TCC1.0+0.4/PTC) U3.5(GPIO3/SCL1)
I2C1_SDA: J4.2 R34.1 U1.P14(PA17/I2C/I1/SERCOM1.1+3.0/TC2.1+TCC1.1+0.5/PTC) U3.3(GPIO2/SDA1)
I2S_BLCK: U1.H15(PB16/I0/SERCOM5.0/I2SCK0/TC6.0+TCC3.0+0.4) U3.12(GPIO18)
I2S_LRCLK: U1.E14(PA20/I4/SERCOM3+5.2/I2SFS0/TC7.0+TCC1.4+0.0/PTC) U3.35(GPIO19)
I2S_SDIN: U1.D15(PA21/I5/SERCOM3+5.3/I2SDO/TC7.1+TCC1.5+0.1/PTC) U3.38(GPIO20)
I2S_SDOUT: U1.D14(PA22/I2C/16/SERCOM3.0+5.1/I2SDI/TC4.0+TCC1.6+0.2/PTC) U3.40(GPIO21)
IR_CTL: R47.2 U1.B5(PB31/I15/SERCOM5.0/TC0.1+TCC4.1+0.7)
IRQ0: R103.1 U1.L15(PC20/I4/TCC0.4/SDHC1.SDCD) U10.2
LCD_BACKLIGHT_CTR: R17.2 U1.N2(PC05/I5/SERCOM6.0)
LCD_CS: R74.2 U1.E15(PB21/SERCOM3.1+7.0/TCC1.3)
LCD_D/C: R57.2 U1.P1(PC06/I6/SERCOM6.2/SDHC0.SDCD)
LCD_MISO: R76.2 U1.G14(PB18/I2/SERCOM5+7.2/TCC1.0+QDI.0)
LCD_MOSI: R75.2 U1.F15(PB19/I3/SERCOM5+7.3/CC1.1/QDI.1)
LCD_RESET: R48.1 U1.P2(PC07/I9/SERCOM6.3/SDHC0.SDWP) U4.2(RESET)
LCD_SCK: R35.2 U1.F14(PB20/I4/SERCOM3.0+7.1/TCC1.2/QDI.2)
LCD_XL: R39.1 U1.P10(PC10/I10/SERCOM6.2+7.2/TCC0.0+1.4)
LCD_XR: R41.1 U1.R10(PC12/I12/SERCOM7.0+6.1/TCC0.2+1.6)
LCD_YD: R42.1 U1.P11(PC13/I13/SERCOM7.1+6.0/TCC0.3+1.7)
LCD_YU: R40.1 U1.R9(PC11/I11/SERCOM6+7.3/TCC0.1+1.5)
LCDVCC_3V3: C29.2 C30.2 C31.2 FB2.2 R48.2 U4.9(VCC) U4.10(LEDA)
MCU_FLASH_QSPI_CLK: U1.R3(PB10/I10/SERCOM4.2/I2SDI/TC5.0+TCC0.4+1.0) U14.6(CLK)
MCU_FLASH_QSPI_CS: R32.1 U1.P5(PB11/I11/SERCOM4.3/I2SFS1/TC5.1+TCC0.5+1.1) U14.1(/CS)
MCU_FLASH_QSPI_IO0: U1.R1(PA08/I2C/AIN0.8+1.2/SERCOM0.0+2.1/I2SMCK1/TC0.0+TCC0.0+1.4/PTC) U14.5(DIO)
MCU_FLASH_QSPI_IO1: U1.P3(PA09/I2C/I9/AIN0.9+1.3/SERCOM0.1+2.0/I2SFS0/TC0.1+TCC0.1+1.5/PTC) U14.2(DO)
MCU_FLASH_QSPI_IO2: R58.1 U1.R2(PA10/I10/AIN0.10/SERCOM0+2.2/I2SCK1/TC1.0+TCC0.2+1.6/PTC) U14.3(/WP)
MCU_FLASH_QSPI_IO3: R59.1 U1.P4(PA11/I11/AIN0.11/SERCOM0+2.3/I2SDO/TC1.1+TCC0.3+1.7) U14.7(/HOLD)
MCU_RESET: D6.2 J3.4 J7.4 R30.2 SW3.1 U1.A8(!RESET)
MIC_OUTPUT: C55.2 U1.A4(PC30/I14/AIN1.12)
N$1: L6.1 U1.A6(VSW)
N$2: R12.2 U1.F2(PA03/I3/VREFA/AIN0.1)
N$3: D2.1 F1.1 USB1.A4_B9(A4/B9/VBUS) USB1.B4_A9(B4/A9/VBUS)
N$4: R1.2 USB1.A5(A5/CC1)
N$5: R2.2 USB1.B5(B5/CC2)
N$6: Q4.3(D) R6.2
N$7: BUZ1.- D5.+ R6.1
N$8: Q4.1(G) R5.2 R7.2
N$10: C12.1 R35.1 U4.3(SCL)
N$11: ANT2.2 C28.2 L3.1
N$12: R69.1 U1.K15(PC22/I6/SERCOM1.0+3.1/TCC0.6)
N$13: R68.1 U1.J14(PC23/I7/SERCOM1.1+3.0/TCC0.7)
N$14: Q7.1(G) Q8.3(D) R91.1 SW3.2
N$15: C13.1 R57.1 U4.4(D/C)
N$16: R65.2 U10.23
N$17: R74.1 U4.5(CS)
N$18: C43.1 R75.1 U4.6(SDA)
N$19: R10.2 U10.22
N$20: Q13.3(D) R83.2
N$21: Q13.1(G) R47.1 R80.1
N$22: C42.1 R76.1 U4.7(SDO)
N$23: Q9.1(G) Q14.1(G) Q16.3(D) R93.2 R94.1
N$24: R66.1 U10.7
N$25: R67.1 U10.10
N$26: R46.1 U4.11(LEDK) U4.12(LEDK) U4.13(LEDK) U4.14(LEDK)
N$27: Q2.1(G) R19.1 R20.2 U9.4(Y)
N$28: Q1.1(G) R16.1 R17.1
N$29: C34.2 R23.1 R24.2
N$30: R18.2 R21.1 U9.1(!OE!) U9.2(A)
N$31: LED1.1(+) R31.2
N$32: R24.1 U2.3(A:+IN1)
N$33: C4.2 C5.2 F1.2 Q2.3(D)
N$35: C34.1 MIC1.1(+) R22.2
N$36: R25.2 R26.1 U2.2(A:-IN1)
N$37: R26.2 U2.1(A:OUT1) U2.5(B:+IN2)
N$38: R27.1 R28.2 U2.6(B:-IN2)
N$39: C50.2 U1.B1(PA01/I1/SERCOM1.1/TC2.1) X2.1
N$40: C36.1 C37.1 C38.1 L6.2 U1.A7(VDDCORE)
N$41: R39.2 U4.15(XL)
N$42: C49.2 U1.A1(PA00/I0/SERCOM1.0/TC2.0) X2.2
N$43: C35.1 R9.1 R30.1
N$44: R40.2 U4.16(YU)
N$45: Q11.2(A:B) Q11.5(B:B) Q11.6(A:C) R98.2
N$46: R41.2 U4.17(XR)
N$47: R42.2 U4.18(YD)
N$48: R81.1 U10.9
N$52: Q1.3(D) R46.2
N$53: R82.1 U10.8
N$54: R77.2 R79.1 U8.2-1 U8.2-2
N$55: Q10.1(G) Q11.3(B:C) R97.2
N$56: D10.- R83.1
N$57: Q8.1(G) R29.1 SW3.4
N$58: Q9.3(D) Q14.3(D)
N$59: C52.1 R8.2 X4.1(X1)
N$60: R50.1 U1.C1(PC00/I1/ADC1.10)
N$61: D7.2(-) Q3.3(D)
N$62: D7.1(+) R51.2
N$63: Q3.1(G) R52.2 R53.2
N$64: D15.1 D15.14 J1.8(DATA1) R60.1
N$66: Q12.3(D) Q15.3(D)
N$67: Q16.1(G) R88.2 R100.2
N$68: C55.1 R27.2 U2.7(B:OUT2)
N$69: Q12.1(G) Q15.1(G) R95.2 R96.1 R99.1
N$70: L5.1 U12.3(SW)
N$72: D15.7 D15.8 J1.1(DATA2) R64.1
N$73: R71.1 R72.2
N$74: C27.2 L3.2 U10.31
N$75: R70.1 R71.2 U12.7(FB)
N$76: D15.2 D15.13 J1.7(DO) R43.1
N$77: D15.3 D15.12 J1.5(SCLK) R44.1
N$78: D15.4 D15.11 J1.3(DI) R45.1
PWR_EN: Q7.3(D) R73.1 R78.2 R90.2 U12.8(EN) U13.3(!SHUTDOWN)
RPI_3V3: Q10.3(D) Q11.1(A:E) Q15.2(S) U3.1(3V3) U3.17(3V3)
RPI_5V: D9.+ Q14.2(S) R20.1 U3.2(5V0) U3.4(5V0)
RTL8720D_CHIP_PU: C9.1 J2.5 J3.10 R11.1 U1.P15(PA18/I2/SERCOM1+3.2/TC3.0+TCC1.2+0.6/PTC) U10.24
RTL8720D_HSPI_CLK: R10.1 R66.2 U1.B13(PB25/SERCOM0.1+2.0/QDI.2)
RTL8720D_HSPI_CS: R82.2 U1.B10(PC25/I9/SERCOM0+2.3/TRACEDATA.2)
RTL8720D_HSPI_MISO: R81.2 U1.A11(PC24/I8/SERCOM0+2.2/TRACEDATA.3)
RTL8720D_HSPI_MOSI: R65.1 R67.2 U1.B14(PB24/I8/SERCOM0.0+2.1/QDI.1)
RTL8720D_RXD: J2.4 J3.9 R69.2 U10.26
RTL8720D_TXD: J2.3 J3.8 R68.2 U10.25
RXD: U1.B12(PB27/I13/SERCOM2.1+4.0/TCC1.3) U3.10(RXD0/GPIO15)
SD_CS: D15.6 D15.9 J1.2(CS) R63.1 U1.L14(PC19/I3/SERCOM6+0.3/TCC0.3)
SD_DET: D8.2 J1.9(CDN) R36.1 U1.H14(PD21/I11/SERCOM1+3.3/TCC1.1/SDHC1.SDWP)
SD_MISO: R43.2 R61.1 U1.M15(PC18/I2/SERCOM6.2+0.2/TCC0.2/QDI.2)
SD_MOSI: R45.2 R62.1 U1.N15(PC16/I0/SERCOM6.0+0.1/TCC0/QDI.0)
SD_SCK: R44.2 U1.M14(PC17/I1/SERCOM6.1+0.0/TCC0.1/QDI.1)
SPI_CS: U1.B3(PB01/I1/AIN0.13/SERCOM5.3/TC7.1/PTC) U3.24(!CE0!/GPIO8)
SPI_MISO: J6.2 U1.A3(PB00/I0/AIN0.12/SERCOM5.2/TC7.0/PTC) U3.21(GPIO9/MISO)
SPI_MOSI: J6.1 U1.A2(PB02/I2/AIN0.14/SERCOM5.0/TC6.0+TCC2.2/PTC) U3.19(GPIO10/MOSI)
SPI_SCK: J6.3 U1.B2(PB03/I3/AIN0.15/SERCOM5.1/TC6.1/PTC) U3.23(GPIO11/SCLK)
SWDCLK: J3.1 J7.1 R33.2 R38.2 U1.B7(PA30/I14/SERCOM1.2/SWCLK)
SWDIO: J3.2 J7.2 R34.2 R54.1 U1.B6(PA31/I15/SERCOM1.3/SWDIO)
SWITCH_B: R86.1 SW1.4 U1.R8(PD12/I7/TCC0.5)
SWITCH_U: R87.1 SW1.6 U1.J15(PD20/I10/SERCOM1+3.2/TCC1.0/SDHC1.SDCD)
SWITCH_X: R37.1 SW1.1 U1.R6(PD08/I3/SERCOM7.0+6.1/TCC0.1)
SWITCH_Y: R85.1 SW1.3 U1.P8(PD09/I4/SERCOM7.1+6.0/TCC0.2)
SWITCH_Z: R84.1 SW1.2 U1.R7(PD10/I5/SERCOM7+6.2/TCC0.3)
SWO: J3.3 J7.3 U1.A5(PB30/I14/SERCOM5.1/TC0.0+TCC4.0+0.6/SWO)
SYNC: R102.1 U1.N14(PA19/I3/SERCOM1+3.3/TC3.1+TCC1.3+0.7/PT) U10.3
TXD: U1.A13(PB26/I12/SERCOM2.0+4.1/TCC1.3) U3.8(TXD0/GPIO14)
USB_5V: C3.2 C8.1 C66.2 C67.2 D9.- J6.19 J6.20 Q2.2(S) Q7.2(S) Q8.2(S) Q9.2(S) R29.2 R73.2 R90.1 R94.2 U12.2(VIN) U13.1(VIN)
USB_D+: R56.1 U1.B15(PA25/19/SERCOM3+5.3/D+)
USB_D-: R55.2 U1.C15(PA24/I8/SERCOM3+5.2/D-)
USB_HOST_EN: R21.2 U1.B8(PA27/I11)
USER_LED: R53.1 U1.R14(PA15/I15/SERCOM2+4.3/TC3.1+TCC2.1+1.3)
VCC3V3_8720: C1.2 C2.2 C6.2 C7.1 C10.1 J2.1 R11.2 R102.2 R103.2 U10.16 U13.5(VOUT)
VCC3V3_MCU_A: C33.1 C60.1 L2.1 R12.1 R22.1 U1.G6(VDDANA0) U1.M2(VDDANA1) U2.8(A:+V)
VCC3V3_MCU_D: C15.1 C16.1 C39.1 C40.1 C41.1 C48.1 C62.1 D1.2 FB3.2 J1.4(VDD) J7.6 R3.2 R4.2 R9.2 R32.2 R36.2 R37.2 R38.1 R49.2 R51.1 R58.2 R59.2 R60.2 R61.2 R62.2 R63.2 R64.2 R84.2 R85.2 R86.2 R87.2 U1.F7(VDDIO7) U1.F8(VDDIO6) U1.F10(VDDIO5) U1.H10(VDDIO4) U1.K6(VDDIOB1) U1.K7(VDDIOB2) U1.K10(VDDIO3) U14.8(VCC)
VCC_3V3: BUZ1.+ C11.2 C14.2 C32.1 C53.1 C54.1 C61.1 C63.+ C64.2 C65.2 D5.- D10.+ FB2.1 FB3.1 J4.3 J5.3 J6.15 J6.16 L2.2 L5.2 Q10.2(S) Q11.4(B:E) Q12.2(S) R13.1 R14.1 R18.1 R31.1 R70.2 R96.2 U5.1(VDD_IO) U5.8(CS) U5.14(VDD) U8.1-1 U8.1-2 U9.5(VCC) U11.8(VCC) U12.5(OUT)
XIN: R8.1 U1.A15(PB22/I6/SERCOM1+5.2/TC7.0/QDI.2)
XOUT: C51.1 U1.A14(PB23/I7/SERCOM1+5.3/TC7.1/QDI.0) X4.3(X2)
Unconnected: J3.5 J3.7 J4.SS1 J4.SS2 J5.SS1 J5.SS2 J6.14 U1.C14(PA23/I2C/I7/SERCOM3.1+5.0/SOF/I2SFS1/TC4.1+TCC1.7+0.3/PTC) U1.P7(PB15/I15/SERCOM4.3/PCC9/TC5.1/TCC4.1+0.3/PTC) U5.2(NC) U5.3(NC) U5.9(INT2) U5.13(ADC3) U5.15(ADC2) U5.16(ADC1) U10.4 U10.5 U10.6 U10.11 U10.12 U10.13 U10.14 U10.17 U10.18 U10.19 U10.20 U10.27 U10.28 U10.29 U11.1(NC) U11.2(NC) U11.3(NC) U11.7(NC) U12.1(PG) U13.4(NC/ADJ) USB1.A8(A8/SBU1) USB1.B8(B8/SBU2)

## Notes on the sheet
- 1 | First version | 20190812 | Milo
- ATSAMD51P19A
- Header Interface and Button
- To guarantee the XOSC32K behavior
  in crystal mode,PC00 must be static
- Close to ATSAMD51P19A power Pin
- Input current 500mA
- ATSAMD51P19A Download
- Power ON
- MCU Reset
- Power OFF
- Power | WIFI+BLE
- Input current:2A
- Input current 600mA
- Close to USB TYPE C
- USB HOST selection
  Power selection
- Input current:2A
- PB14/SPI_DATA0
- PB13/SPI_CLK
- PB16/SPI_CS
- PB17/SPI_DATA1 | ADC6
- Output current:2A | ADC4/TXD
- PB20/TXD/PWM12/I2S_CLK/SPI_DATA0/I2C_SCL | ADC5/RXD/I2C_SDA
- PB21/RXD/PWM13/I2S_WS/SPI_CLK/I2C_SDA
- CHIP_EN | PA25/RXD/USB_DM/I2C_SCL
- UART_LOG_TXD | PA26/TXD/USB_DP
- UART_LOG_RXD | PA28/CTS/PWM6/RREF
- PA30/PWM7/SWD_CLK
- PA27/RTS/SWD_DATA
- HIGH : ON
  LOW : OFF
- PA15/CTS/CS
- PA14/RTS/CLK/I2S_TX2
- 8720 module Download | PA13/RXD/MISO/PWM1/I2S_TX1
- PA12/TXD/MOSI/PWM0/I2S_MCLK
- HIGH : OFF
  LOW : ON
- Gyroscope & LCD
- Buzzer & MIC
- I2C Address 0x19
- Input current 500mA
- Replace with 0R resistance

## Library data of the parts
ANT2 = Connector-new:ANTENNA-2.4G-ANT
BUZ1 = Discrete-new:BUZZER
C1-C16 C27-C43 C48-C55 C60-C62 C64-C67 = Discrete-new:CAP: Ceramic Capacitors
C63 = Discrete-new:CAP-POLAR: Electrolytic Capacitors,Tantalum Capacitors and Super Capacitors
D1-D4 D6 D8 = Discrete-new:D-ESD-2P-DOUBLE
D5 D9 = Discrete-new:DIODE
D7 D10 LED1 = Discrete-new:LED
D15 = Discrete-new:D-ESD-14P
F1 = Discrete-new:FUSE
FB2 FB3 = Discrete-new:FERRITE-BEAD
J1 = Connector-new:MICRO-SD-CARD-HOLDER-9P; SKU: 320090000
J2 = Connector-new:HEADER-5P
J3 = Connector-new:FPC-CONNECTOR-10P
J4 J5 = Connector-new:GROVE-CONNECTOR-SMD
J6 = Connector-new:FPC-CONNECTOR-20P: FH12-20S-0.5SH(55)
J7 = Connector-new:HEADER-6P
K1-K3 = Switch:BUTTON-2+2P
L2 L3 L5 L6 = Discrete-new:INDUCTOR
MIC1 = Connector-new:MIC2P
Q1 Q3 Q4 Q13 Q16 = Discrete-new:MOSFET-N: IRLL014: http://www.vishay.com/docs/91319/sihll014.pdf
Q2 Q7-Q10 Q12 Q14 Q15 = Discrete-new:MOSFET-P
Q11 = Discrete-new:TRANSISTOR-DUAL-PNP
R1-R14 R16-R88 R90 R91 R93-R100 R102 R103 = Discrete-new:RES
SW1 = Switch:SWITCH-2X3P
SW3 = Switch:SWITCH-4P
U1 = IC-new:MCU-ATSAMD51P19A
U2 = IC-new:AMPLIFIER-LMV358; SKU: 111
U3 = moudle-new:RPI-ZERO
U4 = Connector-new:LCM-RY24009A0-00
U5 = Sensor:SENSOR-MOTION/POSITION-LIS3DHTR
U8 = Sensor:SENSOR-PD15-22C/TR8
U9 = IC-new:LOGIC-SN74LVC1G125DCKR
U10 = moudle-new:MODULE-8720DN-MOTHER
U11 = IC-new:DRIVER-ATECC608A
U12 = IC-new:PMIC-MP2161
U13 = IC-new:PMIC-AP2127
U14 = IC-new:FLASH-W25X80: 1M-BIT,2M-BIT,4M-BIT AND 8M-BIT SERIAL FLASH MEMORY WITH 4KB SECTORS AND DUAL OUTPUT SPI
USB1 = Connector-new:USB2.0-TYPE-C
X2 = Discrete-new:CRYSTAL-2P
X4 = Discrete-new:CRYSTAL-4P